# EAGLE design LSM9DS0-breakout (EAGLE 6.5.0)
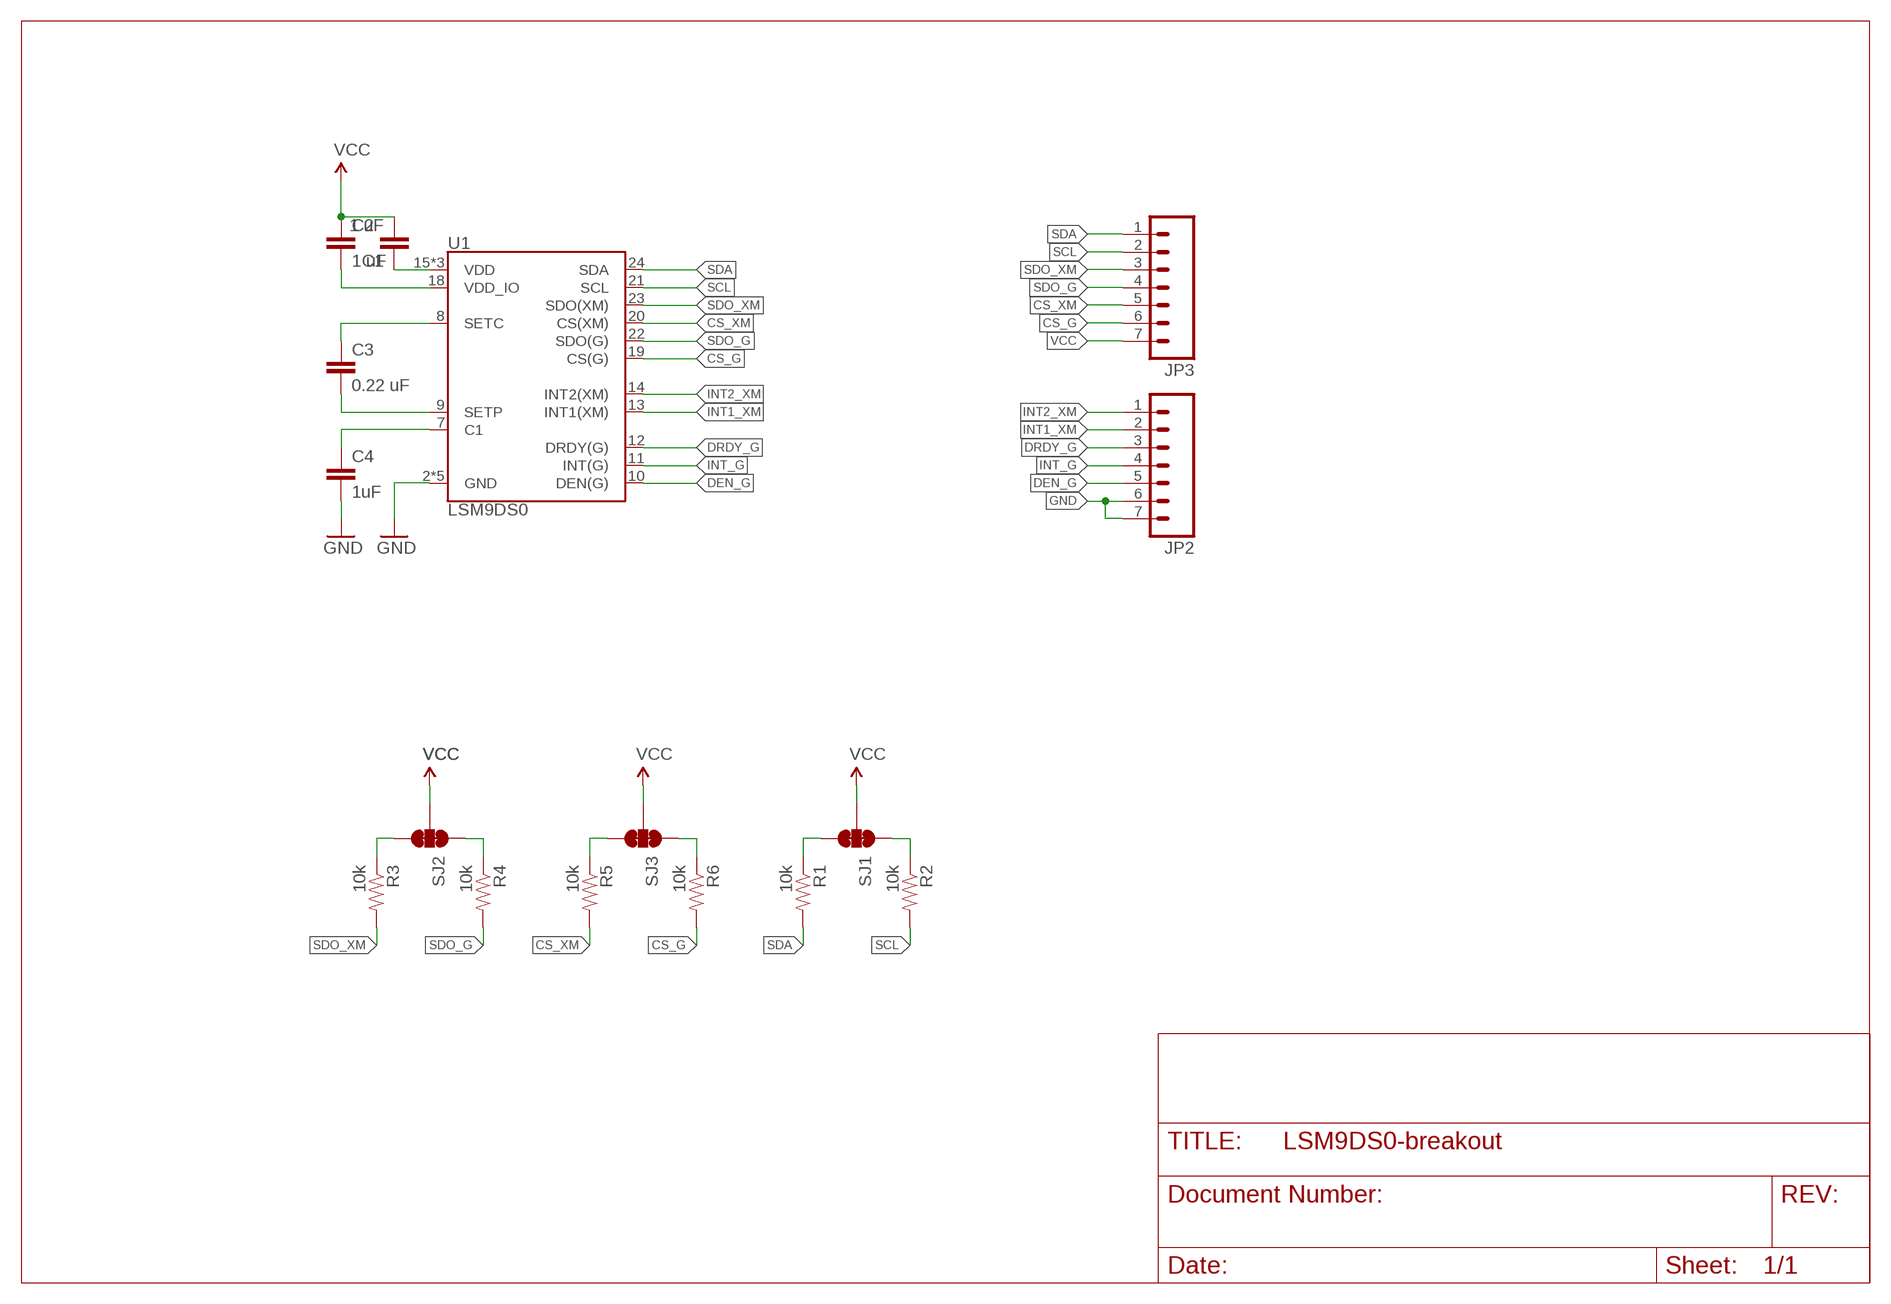
[diagram p0: schematic, sheet 1]

## Parts
C1  1 uF  CAP0603-CAP  [0603-CAP]
C2  1 uF  CAP0603-CAP  [0603-CAP]
C3  0.22 uF  CAP0603-CAP  [0603-CAP]
C4  1uF  CAP0603-CAP  [0603-CAP]
JP2  M07  [1X07]
JP3  M07  [1X07]
R1  10k  RESISTOR0603-RES  [0603-RES]
R2  10k  RESISTOR0603-RES  [0603-RES]
R3  10k  RESISTOR0603-RES  [0603-RES]
R4  10k  RESISTOR0603-RES  [0603-RES]
R5  10k  RESISTOR0603-RES  [0603-RES]
R6  10k  RESISTOR0603-RES  [0603-RES]
SJ1  JUMPER-PAD-3-NC_BY_TRACE  [PAD-JUMPER-3-3OF3_NC_BY_TRACE_YES_SILK_FULL_BOX]
SJ2  JUMPER-PAD-3-NC_BY_TRACE  [PAD-JUMPER-3-3OF3_NC_BY_TRACE_YES_SILK_FULL_BOX]
SJ3  JUMPER-PAD-3-NC_BY_TRACE  [PAD-JUMPER-3-3OF3_NC_BY_TRACE_YES_SILK_FULL_BOX]
U1  LSM9DS0  [LGA-24]

## Nets
CS_G: JP3.6 R6.2 U1.19(CS(G))
CS_XM: JP3.5 R5.2 U1.20(CS(XM))
DEN_G: JP2.5 U1.10(DEN(G))
DRDY_G: JP2.3 U1.12(DRDY(G))
GND: C4.2 JP2.6 JP2.7 U1.2(GND) U1.3(GND) U1.4(GND) U1.5(GND) U1.6(GND)
INT1_XM: JP2.2 U1.13(INT1(XM))
INT2_XM: JP2.1 U1.14(INT2(XM))
INT_G: JP2.4 U1.11(INT(G))
N$1: C3.1 U1.8(SETC)
N$2: C3.2 U1.9(SETP)
N$3: C4.1 U1.7(C1)
N$4: C1.1 U1.15(VDD) U1.16(VDD) U1.17(VDD)
N$5: C2.2 U1.18(VDD_IO)
N$7: R3.1 SJ2.3
N$8: R4.1 SJ2.1
N$9: R5.1 SJ3.3
N$10: R6.1 SJ3.1
N$11: R1.1 SJ1.3
N$12: R2.1 SJ1.1
SCL: JP3.2 R2.2 U1.21(SCL)
SDA: JP3.1 R1.2 U1.24(SDA)
SDO_G: JP3.4 R4.2 U1.22(SDO(G))
SDO_XM: JP3.3 R3.2 U1.23(SDO(XM))
VCC: C1.2 C2.1 JP3.7 SJ1.2 SJ2.2 SJ3.2

## Library data of the parts
C1-C4 = SparkFun-Capacitors:CAP: Capacitor Standard 0603 ceramic capacitor, and 0.1" leaded capacitor.
JP2 JP3 = SparkFun-Connectors:M07: Header 7 Standard 7-pin 0.1" header. Use with straight break away headers (SKU : PRT-00116), right angle break away headers (PRT-00553), swiss pins (PRT-00743), machine pins (PRT-00117), and female headers (PRT-00115). NOTES ON THE VARIANTS LOCK and LOCK_LONGPADS... This footprint was designed to help hold the alignment of a through-hole component (i.e. 7-pin header) while soldering it into place. You may notice that each hole has been shifted either up or down by 0.005 of an inch from it's more standard position (which is usually a perfectly straight line). This slight alteration caused the pins (the squares in the middle) to touch the edges of the holes. Because they are alternating, it causes a "brace" to hold the header in place. 0.005 has proven to be the perfect amount of "off-center" position when using our standard breakaway headers. Although looks a little odd when you look at the bare footprint, once you have a header in there, the alteration is very hard to notice. Also, if you push a header all the way into place, it is covered up entirely on the bottom side. This idea of altering the position of holes to aid alignment will be further integrated into the Sparkfun Library for other footprints. It can help hold any component with 3 or more connection pins.
R1-R6 = SparkFun-Passives:RESISTOR: Resistor Basic schematic elements and footprints for 0603, 1206, and PTH resistors.
SJ1-SJ3 = SparkFun-Passives:JUMPER-PAD-3-NC_BY_TRACE
U1 = SparkFun-DigitalIC:LSM9DS0: LSM9DS0 3D Accelerometer, 3D Gyroscope, 3D Magnetomter Features: 3 acceleration channels, 3 angular rate channels, 3 magnetic field channels ±2/±4/±6/±8/±16 g linear acceleration full scale ±2/±4/±8/±12 gauss magnetic full scale ±245/±500/±2000 dps angular rate full scale 16-bit data output SPI / I2C serial interfaces Analog supply voltage 2.4 V to 3.6 V Power-down mode / low-power mode Programmable interrupt generators Embedded self-test Embedded temperature sensor Embedded FIFO Position and motion detection functions Click/double-click recognition

## Board
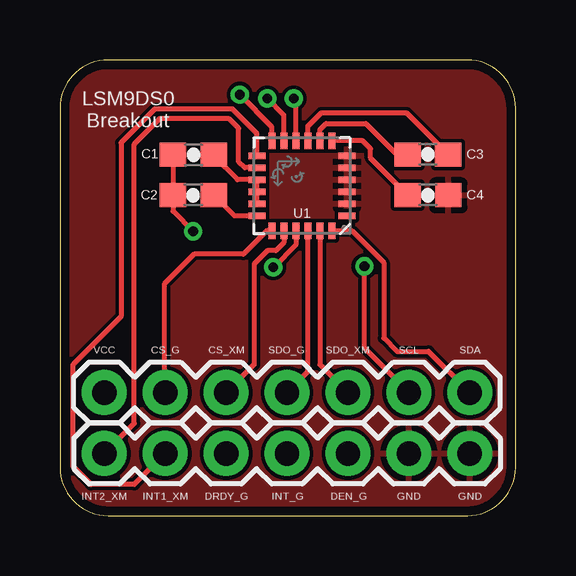
[diagram p1: board, top side]
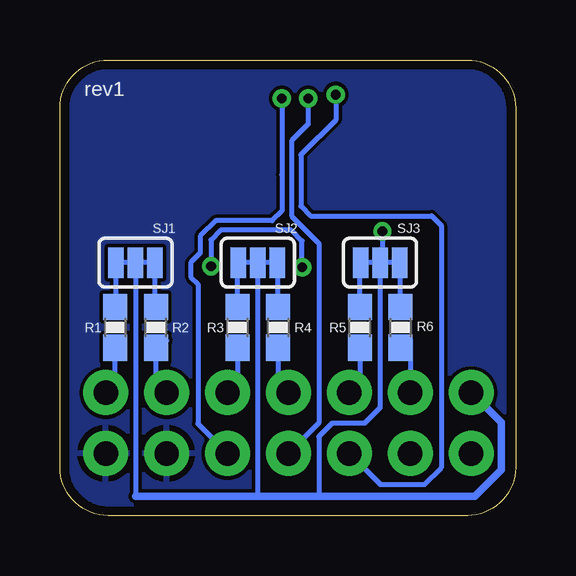
[diagram p2: board, bottom side, seen from below]

Size 19 x 19 mm. Coordinates in mm from the lower left corner, seen from the top.
Outline: 2,0 17,0 arc90 19,2 19,17 arc90 17,19 2,19 arc90 0,17 0,2 arc90 2,0
Copper layers (1*16): Top 0.0356mm / dielectric 1.5011mm / Bottom 0.0356mm
Design rules "LaenPCBOrder": minimum track width 6mil, minimum drill 13mil, track to track 6mil, track to pad 6mil, pad to pad 6mil, via to via 6mil, smd to smd 6mil, copper to edge 15mil, drill to drill 6mil, minimum pad ring 7mil, minimum via ring 7mil, stop-mask expansion 3mil, vias tented up to drill 0mil, thermal gap 10mil

### Footprints (pad centres in the part's own frame; a part is rotated, then mirrored left to right if it is on the bottom)
0603-CAP = smd 1.1 x 1: 1 -0.85,0; 2 0.85,0
1X07 = drill 1.016 pad 1.88: 1 0,0; 2 2.54,0; 3 5.08,0; 4 7.62,0; 5 10.16,0; 6 12.7,0; 7 15.24,0
0603-RES = smd 1.1 x 1: 1 -0.85,0; 2 0.85,0
PAD-JUMPER-3-3OF3_NC_BY_TRACE_YES_SILK_FULL_BOX = smd 0.635 x 1.27: 1 -0.813,0; 2 0,0; 3 0.813,0
LGA-24 = smd 0.7 x 0.29: 1 -1.875,1.25; 2 -1.875,0.75; 3 -1.875,0.25; 4 -1.875,-0.25; 5 -1.875,-0.75; 6 -1.875,-1.25; 13 1.875,-1.25; 14 1.875,-0.75; 15 1.875,-0.25; 16 1.875,0.25; 17 1.875,0.75; 18 1.875,1.25 | smd 0.29 x 0.7: 7 -1.25,-1.875; 8 -0.75,-1.875; 9 -0.25,-1.875; 10 0.25,-1.875; 11 0.75,-1.875; 12 1.25,-1.875; 19 1.25,1.875; 20 0.75,1.875; 21 0.25,1.875; 22 -0.25,1.875; 23 -0.75,1.875; 24 -1.25,1.875

### Placement (x,y rotation side)
C1  5.57,15.05 180 top
C2  5.56,13.36 0 top
C3  15.35,15.06 0 top
C4  15.35,13.36 0 top
JP2  1.85,2.59 0 top
JP3  17.09,5.13 180 top
R1  16.7,7.85 270 bottom
R2  15,7.85 270 bottom
R3  11.6,7.85 270 bottom
R4  9.9,7.85 270 bottom
R5  6.5,7.85 270 bottom
R6  4.8,7.85 270 bottom
SJ1  15.85,10.55 180 bottom
SJ2  10.75,10.55 180 bottom
SJ3  5.65,10.55 180 bottom
U1  10.09,13.75 180 top

### Tracks (layer width: path | path; a pad name or v marks a point on that pad's centre or on a via)
CS_G
  Top 0.203: U1.19 8.63,11.88 7.65,10.9 5.6,10.9 4.35,9.65 4.35,5.17 JP3.6
  Bottom 0.203: R6.2 4.39,7.36 JP3.6
CS_XM
  Top 0.203: U1.20 9.34,11.39 9,11.05 8.65,11.05 8.1,10.5 8.1,6.3 JP3.5
  Bottom 0.203: R5.2 6.5,5.56 JP3.5
DEN_G  (via drill 0.41)
  Top 0.203: U1.10 9.84,17.31 v9.75,17.4
  Bottom 0.203: JP2.5 13.25,3.83 13.25,9.65 13.55,9.95 13.55,10.55 13.15,10.95 | v9.75,17.4 9.75,14.2
  Bottom 0.204: 9.75,14.2 9.75,12.7 10.15,12.3 12.5,12.3 13.15,11.65 13.15,10.95
DRDY_G  (via drill 0.41)
  Top 0.203: U1.12 8.84,16.21 v7.5,17.55
  Bottom 0.203: JP2.3 5.64,1.3 3.8,1.3 3.1,2
  Bottom 0.204: v7.5,17.55 7.5,16.5 8.95,15.05 8.95,12.9 8.55,12.5 3.5,12.5 3.1,12.1 3.1,2
GND
  pour Bottom: 0,0 0,19 19,19 19,0
  pour Top: 0,0 0,19 19,19 19,0
INT1_XM
  Top 0.203: JP2.2 3.1,1.3 1.3,1.3 0.55,2.05 0.55,6.3 2.55,8.3 2.55,15.55 3.95,16.95 7.2,16.95 8.22,15.93 U1.13
INT2_XM
  Top 0.203: JP2.1 3.1,3.84 3.1,15.5 4.15,16.55 7.05,16.55 7.45,16.15 7.45,14.75 7.7,14.5 U1.14
INT_G  (via drill 0.41)
  Top 0.203: U1.11 9.34,16.71 v8.65,17.4
  Bottom 0.203: JP2.4 8.2,3.86
  Bottom 0.204: v8.65,17.4 8.65,16.32 U1.11 9.34,12.49 8.2,11.35 8.2,3.86
N$1
  Top 0.203: U1.8 10.84,16.09 11.1,16.35 12.75,16.35 14.04,15.06 C3.1
N$2
  Top 0.203: U1.9 10.34,16.24 10.9,16.8 14.45,16.8 C3.2
N$3
  Top 0.203: C4.1 12.95,14.91 12.95,15.3 12.62,15.63 U1.7
N$4
  Top 0.203: U1.17 U1.16 U1.15 7.4,14 6.42,14.98 C1.1
N$5
  Top 0.203: C2.2 7.27,12.5 U1.18
N$7
  Bottom 0.203: R3.1 11.6,10.51 SJ2.3
N$8
  Bottom 0.203: 9.9,10.54 SJ2.1 9.9,10.51 R4.1
N$9
  Bottom 0.203: R5.1 6.5,10.51 SJ3.3
N$10
  Bottom 0.203: 4.69,8.71 R6.1 4.8,10.51 SJ3.1
N$11
  Bottom 0.203: R1.1 16.66,8.74 SJ1.3
N$12
  Bottom 0.203: R2.1 15.04,8.74 SJ1.1
SCL  (via drill 0.41)
  Top 0.203: U1.21 9.84,11.29 v8.9,10.35 | JP3.2 12.7,6.98 v12.7,10.4
  Bottom 0.203: 14.55,7.3 R2.2 15,5.58 JP3.2
  Bottom 0.204: v8.9,10.35 8.9,11.45 9.35,11.9 12.3,11.9 12.7,11.5 v12.7,10.4
SDA
  Top 0.203: U1.24 12.18,11.88 13.5,10.55 13.5,7.4 14.05,6.85 15.37,6.85 JP3.1
  Bottom 0.203: 17.09,7.11 R1.2 16.7,5.52 JP3.1
SDO_G
  Top 0.203: JP3.4 10.34,6 U1.22
  Bottom 0.203: R4.2 9.9,5.56 JP3.4
SDO_XM
  Top 0.203: U1.23 10.84,6.3 JP3.3
  Bottom 0.203: R3.2 11.6,5.54 JP3.3
VCC  (via drill 0.41)
  Top 0.203: C2.1 | C1.2 C2.1 | C2.1 4.71,12.69 v5.55,11.85
  Bottom 0.203: v5.55,11.85 5.55,11.2 arc90 5.7,11.05 5.65,11 SJ3.2 5.65,4.5 6.3,3.85 7.65,3.85 8.2,3.3 8.2,0.8 | 10.75,0.8 SJ2.2 | SJ1.2 15.85,0.8
  Bottom 0.305: 15.85,0.8 10.75,0.8 8.2,0.8 1.7,0.8 0.6,1.9 0.6,3.88 JP3.7

### Text on the board
tPlace: LSM9DS0 / Breakout | VCC | CS_G | CS_XM | SDO_G | SDO_XM | SCL | SDA | INT2_XM | INT1_XM | DRDY_G | INT_G | DEN_G | GND | GND
bPlace: rev1